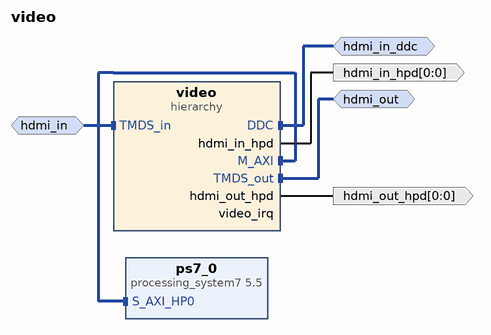
[diagram p0: block diagram of the top level]
# Vivado block design video, xc7z020clg400-1, Vivado 2018.2
create_bd_design video

create_bd_intf_port -mode Slave -vlnv digilentinc.com:interface:tmds_rtl:1.0 hdmi_in
create_bd_intf_port -mode Master -vlnv xilinx.com:interface:iic_rtl:1.0 hdmi_in_ddc
create_bd_intf_port -mode Master -vlnv digilentinc.com:interface:tmds_rtl:1.0 hdmi_out
create_bd_port -dir O -from 0 -to 0 hdmi_in_hpd
create_bd_port -dir O -from 0 -to 0 hdmi_out_hpd

create_bd_cell -type ip -vlnv xilinx.com:ip:processing_system7:5.5 ps7_0
set_property -dict [list \
  CONFIG.PCW_FCLK_CLK1_BUF TRUE \
  CONFIG.PCW_FCLK_CLK2_BUF TRUE \
  CONFIG.PCW_FCLK_CLK3_BUF TRUE \
  CONFIG.PCW_UIPARAM_DDR_FREQ_MHZ 525 \
  CONFIG.PCW_CRYSTAL_PERIPHERAL_FREQMHZ 50 \
  CONFIG.PCW_APU_PERIPHERAL_FREQMHZ 650 \
  CONFIG.PCW_SDIO_PERIPHERAL_FREQMHZ 50 \
  CONFIG.PCW_UART_PERIPHERAL_FREQMHZ 100 \
  CONFIG.PCW_I2C_PERIPHERAL_FREQMHZ 108.333336 \
  CONFIG.PCW_FPGA0_PERIPHERAL_FREQMHZ 100 \
  CONFIG.PCW_FPGA1_PERIPHERAL_FREQMHZ 142 \
  CONFIG.PCW_FPGA2_PERIPHERAL_FREQMHZ 200 \
  CONFIG.PCW_FPGA3_PERIPHERAL_FREQMHZ 100 \
  CONFIG.PCW_USE_M_AXI_GP1 1 \
  CONFIG.PCW_USE_S_AXI_GP0 1 \
  CONFIG.PCW_USE_S_AXI_HP0 1 \
  CONFIG.PCW_USE_S_AXI_HP2 1 \
  CONFIG.PCW_USE_FABRIC_INTERRUPT 1 \
  CONFIG.PCW_GPIO_EMIO_GPIO_WIDTH 10 \
  CONFIG.PCW_EN_CLK1_PORT 1 \
  CONFIG.PCW_EN_CLK2_PORT 1 \
  CONFIG.PCW_EN_CLK3_PORT 1 \
  CONFIG.PCW_IRQ_F2P_INTR 1 \
  CONFIG.PCW_PERIPHERAL_BOARD_PRESET None \
  CONFIG.PCW_PRESET_BANK1_VOLTAGE {LVCMOS 1.8V} \
  CONFIG.PCW_UIPARAM_DDR_BUS_WIDTH {16 Bit} \
  CONFIG.PCW_UIPARAM_DDR_PARTNO Custom \
  CONFIG.PCW_QSPI_PERIPHERAL_ENABLE 1 \
  CONFIG.PCW_QSPI_QSPI_IO {MIO 1 .. 6} \
  CONFIG.PCW_QSPI_GRP_SINGLE_SS_ENABLE 1 \
  CONFIG.PCW_QSPI_GRP_SINGLE_SS_IO {MIO 1 .. 6} \
  CONFIG.PCW_SINGLE_QSPI_DATA_MODE x4 \
  CONFIG.PCW_QSPI_GRP_FBCLK_ENABLE 1 \
  CONFIG.PCW_QSPI_GRP_FBCLK_IO {MIO 8} \
  CONFIG.PCW_ENET0_PERIPHERAL_ENABLE 1 \
  CONFIG.PCW_ENET0_ENET0_IO {MIO 16 .. 27} \
  CONFIG.PCW_ENET0_GRP_MDIO_ENABLE 1 \
  CONFIG.PCW_ENET0_GRP_MDIO_IO {MIO 52 .. 53} \
  CONFIG.PCW_SD0_PERIPHERAL_ENABLE 1 \
  CONFIG.PCW_SD0_SD0_IO {MIO 40 .. 45} \
  CONFIG.PCW_SD0_GRP_CD_ENABLE 1 \
  CONFIG.PCW_SD0_GRP_CD_IO {MIO 47} \
  CONFIG.PCW_SD0_GRP_WP_ENABLE 0 \
  CONFIG.PCW_UART0_PERIPHERAL_ENABLE 1 \
  CONFIG.PCW_UART0_UART0_IO {MIO 14 .. 15} \
  CONFIG.PCW_UART1_PERIPHERAL_ENABLE 0 \
  CONFIG.PCW_USB0_PERIPHERAL_ENABLE 1 \
  CONFIG.PCW_USB0_USB0_IO {MIO 28 .. 39} \
  CONFIG.PCW_I2C0_PERIPHERAL_ENABLE 1 \
  CONFIG.PCW_I2C0_I2C0_IO {MIO 50 .. 51} \
  CONFIG.PCW_I2C0_GRP_INT_ENABLE 1 \
  CONFIG.PCW_I2C0_GRP_INT_IO EMIO \
  CONFIG.PCW_I2C1_PERIPHERAL_ENABLE 1 \
  CONFIG.PCW_I2C1_I2C1_IO EMIO \
  CONFIG.PCW_GPIO_MIO_GPIO_ENABLE 0 \
  CONFIG.PCW_GPIO_EMIO_GPIO_ENABLE 1 \
  CONFIG.PCW_GPIO_EMIO_GPIO_IO 10 \
  CONFIG.PCW_FPGA_FCLK1_ENABLE 1 \
  CONFIG.PCW_FPGA_FCLK2_ENABLE 1 \
  CONFIG.PCW_FPGA_FCLK3_ENABLE 1 \
] [get_bd_cells ps7_0]
# 491 more settings of ps7_0 are not shown: defaults, MIO pin electricals, DDR timing, and values the tool derives
create_bd_cell -type hier video

# ---- hierarchy /video ----
current_bd_instance /video
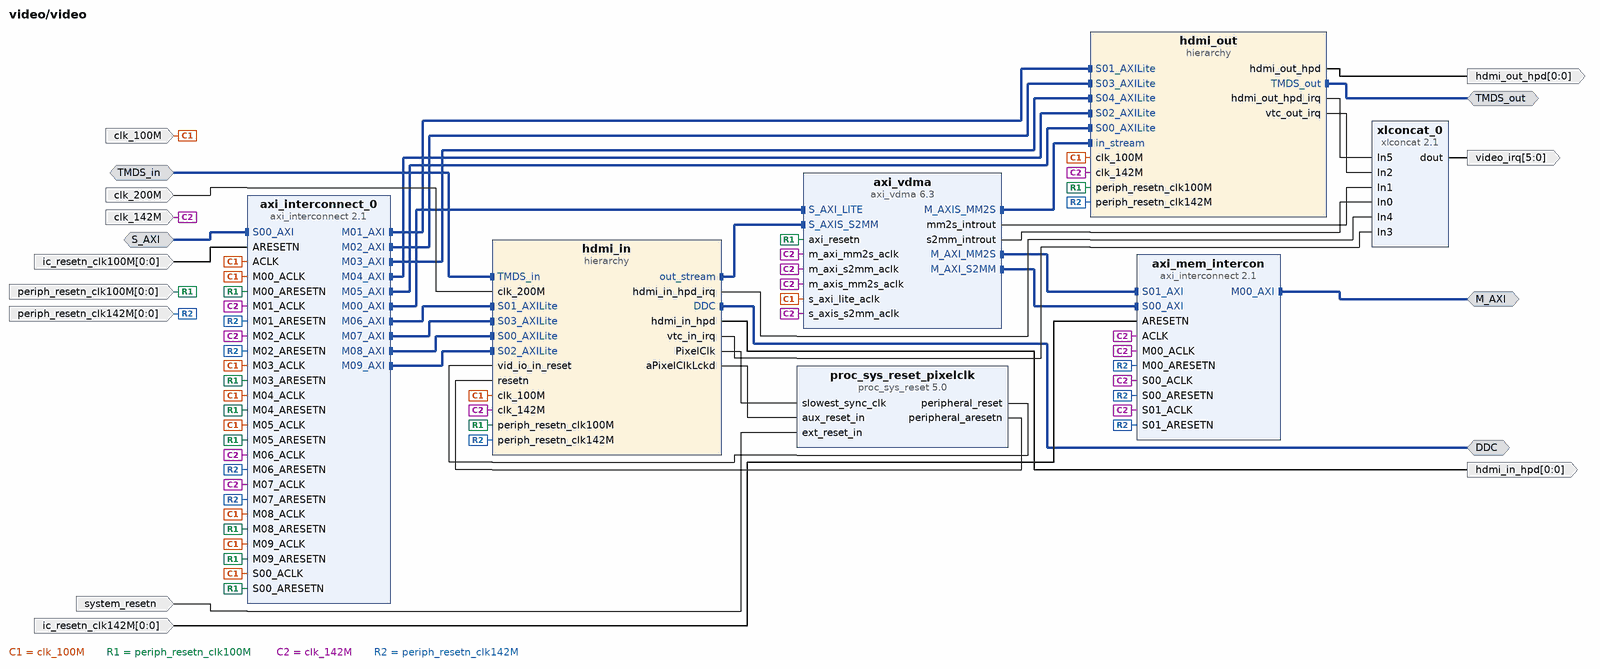
[diagram p1: block diagram inside /video]
create_bd_intf_pin -mode Master -vlnv xilinx.com:interface:iic_rtl:1.0 DDC
create_bd_intf_pin -mode Master -vlnv xilinx.com:interface:aximm_rtl:1.0 M_AXI
create_bd_intf_pin -mode Slave -vlnv xilinx.com:interface:aximm_rtl:1.0 S_AXI
create_bd_intf_pin -mode Slave -vlnv digilentinc.com:interface:tmds_rtl:1.0 TMDS_in
create_bd_intf_pin -mode Master -vlnv digilentinc.com:interface:tmds_rtl:1.0 TMDS_out
create_bd_pin -dir I -type clk clk_100M
create_bd_pin -dir I clk_142M
create_bd_pin -dir I -type clk clk_200M
create_bd_pin -dir O -from 0 -to 0 hdmi_in_hpd
create_bd_pin -dir O -from 0 -to 0 hdmi_out_hpd
create_bd_pin -dir I -from 0 -to 0 -type rst ic_resetn_clk100M
create_bd_pin -dir I -from 0 -to 0 -type rst ic_resetn_clk142M
create_bd_pin -dir I -from 0 -to 0 -type rst periph_resetn_clk100M
create_bd_pin -dir I -from 0 -to 0 -type rst periph_resetn_clk142M
create_bd_pin -dir I -type rst system_resetn
create_bd_pin -dir O -from 5 -to 0 video_irq

create_bd_cell -type ip -vlnv xilinx.com:ip:axi_interconnect:2.1 axi_interconnect_0
set_property -dict [list \
  CONFIG.NUM_MI 10 \
  CONFIG.M00_HAS_REGSLICE 1 \
  CONFIG.M01_HAS_REGSLICE 1 \
  CONFIG.M02_HAS_REGSLICE 1 \
  CONFIG.M03_HAS_REGSLICE 1 \
  CONFIG.M04_HAS_REGSLICE 1 \
  CONFIG.M05_HAS_REGSLICE 1 \
  CONFIG.M06_HAS_REGSLICE 1 \
  CONFIG.M07_HAS_REGSLICE 1 \
  CONFIG.M08_HAS_REGSLICE 1 \
  CONFIG.M09_HAS_REGSLICE 1 \
  CONFIG.S00_HAS_REGSLICE 1 \
] [get_bd_cells axi_interconnect_0]
create_bd_cell -type ip -vlnv xilinx.com:ip:axi_interconnect:2.1 axi_mem_intercon
set_property -dict {CONFIG.NUM_SI 2 CONFIG.NUM_MI 1} [get_bd_cells axi_mem_intercon]
create_bd_cell -type ip -vlnv xilinx.com:ip:axi_vdma:6.3 axi_vdma
set_property -dict [list \
  CONFIG.c_m_axi_mm2s_data_width 32 \
  CONFIG.c_m_axis_mm2s_tdata_width 32 \
  CONFIG.c_num_fstores 4 \
  CONFIG.c_mm2s_genlock_mode 1 \
  CONFIG.c_s2mm_genlock_mode 0 \
  CONFIG.c_mm2s_linebuffer_depth 512 \
  CONFIG.c_s2mm_linebuffer_depth 4096 \
  CONFIG.c_mm2s_max_burst_length 32 \
  CONFIG.c_s2mm_max_burst_length 32 \
] [get_bd_cells axi_vdma]
create_bd_cell -type hier hdmi_in
create_bd_cell -type hier hdmi_out
create_bd_cell -type ip -vlnv xilinx.com:ip:proc_sys_reset:5.0 proc_sys_reset_pixelclk
create_bd_cell -type ip -vlnv xilinx.com:ip:xlconcat:2.1 xlconcat_0
set_property -dict {CONFIG.NUM_PORTS 6} [get_bd_cells xlconcat_0]

# ---- hierarchy /video/hdmi_in ----
current_bd_instance /video/hdmi_in
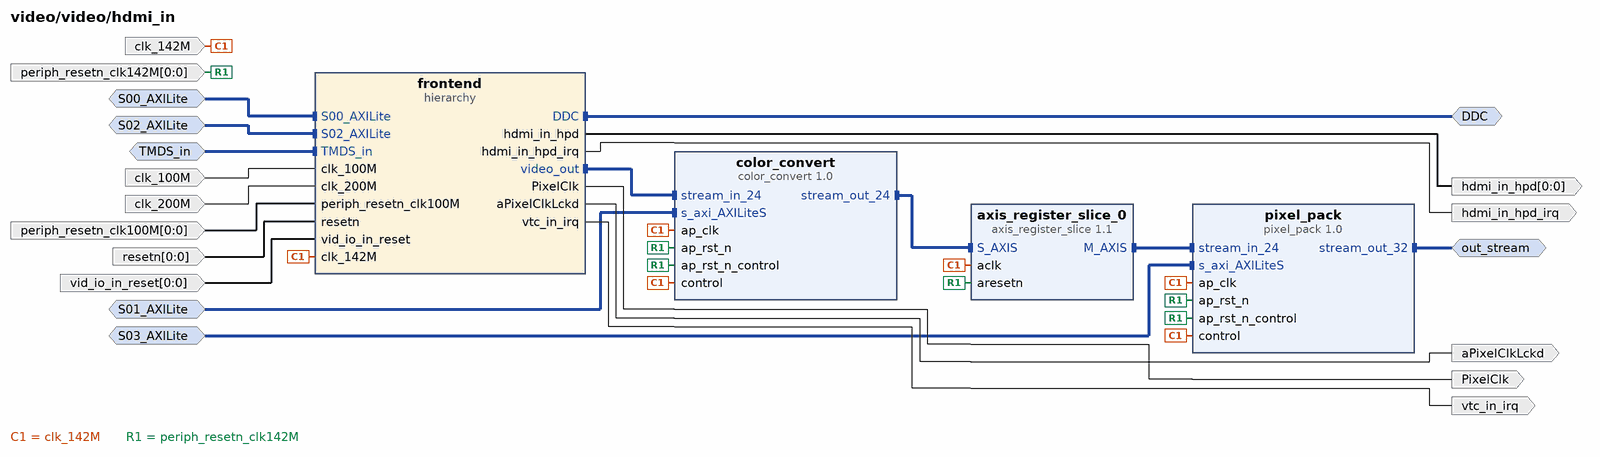
[diagram p2: block diagram inside /video/hdmi_in]
create_bd_intf_pin -mode Master -vlnv xilinx.com:interface:iic_rtl:1.0 DDC
create_bd_intf_pin -mode Slave -vlnv xilinx.com:interface:aximm_rtl:1.0 S00_AXILite
create_bd_intf_pin -mode Slave -vlnv xilinx.com:interface:aximm_rtl:1.0 S01_AXILite
create_bd_intf_pin -mode Slave -vlnv xilinx.com:interface:aximm_rtl:1.0 S02_AXILite
create_bd_intf_pin -mode Slave -vlnv xilinx.com:interface:aximm_rtl:1.0 S03_AXILite
create_bd_intf_pin -mode Slave -vlnv digilentinc.com:interface:tmds_rtl:1.0 TMDS_in
create_bd_intf_pin -mode Master -vlnv xilinx.com:interface:axis_rtl:1.0 out_stream
create_bd_pin -dir O -type clk PixelClk
create_bd_pin -dir O aPixelClkLckd
create_bd_pin -dir I -type clk clk_100M
create_bd_pin -dir I -type clk clk_142M
create_bd_pin -dir I -type clk clk_200M
create_bd_pin -dir O -from 0 -to 0 hdmi_in_hpd
create_bd_pin -dir O -type intr hdmi_in_hpd_irq
create_bd_pin -dir I -from 0 -to 0 -type rst periph_resetn_clk100M
create_bd_pin -dir I -from 0 -to 0 -type rst periph_resetn_clk142M
create_bd_pin -dir I -from 0 -to 0 -type rst resetn
create_bd_pin -dir I -from 0 -to 0 -type rst vid_io_in_reset
create_bd_pin -dir O -type intr vtc_in_irq

create_bd_cell -type ip -vlnv xilinx.com:ip:axis_register_slice:1.1 axis_register_slice_0
create_bd_cell -type ip -vlnv xilinx.com:hls:color_convert:1.0 color_convert
create_bd_cell -type hier frontend
create_bd_cell -type ip -vlnv xilinx.com:hls:pixel_pack:1.0 pixel_pack

# ---- hierarchy /video/hdmi_in/frontend ----
current_bd_instance /video/hdmi_in/frontend
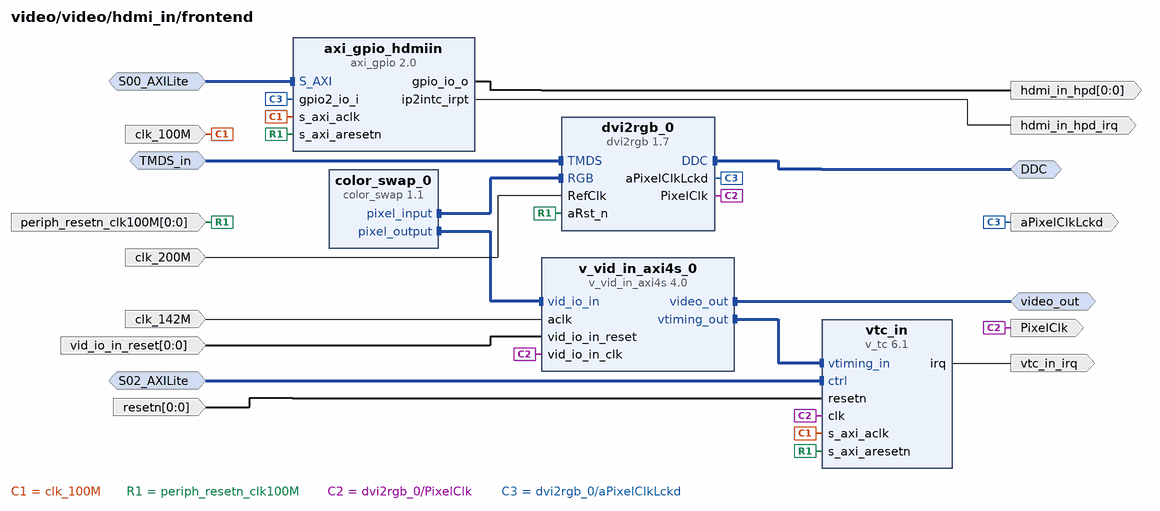
[diagram p3: block diagram inside /video/hdmi_in/frontend]
create_bd_intf_pin -mode Master -vlnv xilinx.com:interface:iic_rtl:1.0 DDC
create_bd_intf_pin -mode Slave -vlnv xilinx.com:interface:aximm_rtl:1.0 S00_AXILite
create_bd_intf_pin -mode Slave -vlnv xilinx.com:interface:aximm_rtl:1.0 S02_AXILite
create_bd_intf_pin -mode Slave -vlnv digilentinc.com:interface:tmds_rtl:1.0 TMDS_in
create_bd_intf_pin -mode Master -vlnv xilinx.com:interface:axis_rtl:1.0 video_out
create_bd_pin -dir O -type clk PixelClk
create_bd_pin -dir O aPixelClkLckd
create_bd_pin -dir I -type clk clk_100M
create_bd_pin -dir I -type clk clk_142M
create_bd_pin -dir I -type clk clk_200M
create_bd_pin -dir O -from 0 -to 0 hdmi_in_hpd
create_bd_pin -dir O -type intr hdmi_in_hpd_irq
create_bd_pin -dir I -from 0 -to 0 -type rst periph_resetn_clk100M
create_bd_pin -dir I -from 0 -to 0 -type rst resetn
create_bd_pin -dir I -from 0 -to 0 -type rst vid_io_in_reset
create_bd_pin -dir O -type intr vtc_in_irq

create_bd_cell -type ip -vlnv xilinx.com:ip:axi_gpio:2.0 axi_gpio_hdmiin
set_property -dict [list \
  CONFIG.C_GPIO_WIDTH 1 \
  CONFIG.C_GPIO2_WIDTH 1 \
  CONFIG.C_IS_DUAL 1 \
  CONFIG.C_ALL_INPUTS_2 1 \
  CONFIG.C_INTERRUPT_PRESENT 1 \
  CONFIG.C_ALL_OUTPUTS 1 \
] [get_bd_cells axi_gpio_hdmiin]
create_bd_cell -type ip -vlnv xilinx.com:user:color_swap:1.1 color_swap_0
set_property -dict {CONFIG.input_format rbg CONFIG.output_format rgb} [get_bd_cells color_swap_0]
create_bd_cell -type ip -vlnv digilentinc.com:ip:dvi2rgb:1.7 dvi2rgb_0
set_property -dict [list \
  CONFIG.kRstActiveHigh false \
  CONFIG.kClkRange 1 \
  CONFIG.kAddBUFG false \
  CONFIG.kEdidFileName 720p_edid.data \
] [get_bd_cells dvi2rgb_0]
create_bd_cell -type ip -vlnv xilinx.com:ip:v_vid_in_axi4s:4.0 v_vid_in_axi4s_0
set_property -dict {CONFIG.C_HAS_ASYNC_CLK 1 CONFIG.C_ADDR_WIDTH 12} [get_bd_cells v_vid_in_axi4s_0]
create_bd_cell -type ip -vlnv xilinx.com:ip:v_tc:6.1 vtc_in
set_property -dict [list \
  CONFIG.HAS_INTC_IF true \
  CONFIG.max_lines_per_frame 2048 \
  CONFIG.horizontal_blank_detection false \
  CONFIG.enable_generation false \
  CONFIG.vertical_blank_detection false \
] [get_bd_cells vtc_in]

# ---- hierarchy /video/hdmi_out ----
current_bd_instance /video/hdmi_out
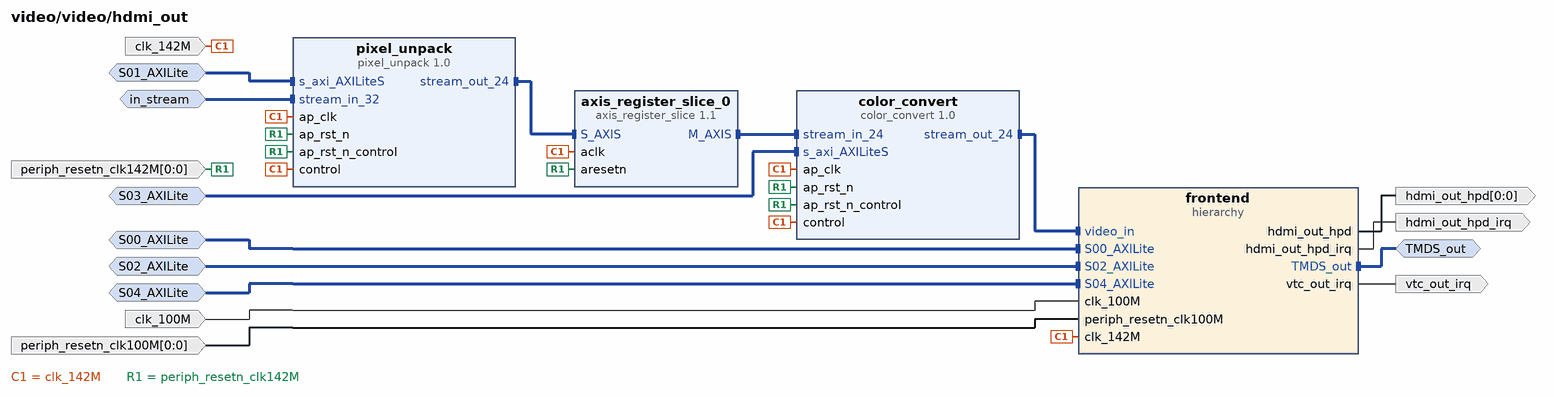
[diagram p4: block diagram inside /video/hdmi_out]
create_bd_intf_pin -mode Slave -vlnv xilinx.com:interface:aximm_rtl:1.0 S00_AXILite
create_bd_intf_pin -mode Slave -vlnv xilinx.com:interface:aximm_rtl:1.0 S01_AXILite
create_bd_intf_pin -mode Slave -vlnv xilinx.com:interface:aximm_rtl:1.0 S02_AXILite
create_bd_intf_pin -mode Slave -vlnv xilinx.com:interface:aximm_rtl:1.0 S03_AXILite
create_bd_intf_pin -mode Slave -vlnv xilinx.com:interface:aximm_rtl:1.0 S04_AXILite
create_bd_intf_pin -mode Master -vlnv digilentinc.com:interface:tmds_rtl:1.0 TMDS_out
create_bd_intf_pin -mode Slave -vlnv xilinx.com:interface:axis_rtl:1.0 in_stream
create_bd_pin -dir I -type clk clk_100M
create_bd_pin -dir I -type clk clk_142M
create_bd_pin -dir O -from 0 -to 0 hdmi_out_hpd
create_bd_pin -dir O -type intr hdmi_out_hpd_irq
create_bd_pin -dir I -from 0 -to 0 -type rst periph_resetn_clk100M
create_bd_pin -dir I -from 0 -to 0 -type rst periph_resetn_clk142M
create_bd_pin -dir O -type intr vtc_out_irq

create_bd_cell -type ip -vlnv xilinx.com:ip:axis_register_slice:1.1 axis_register_slice_0
create_bd_cell -type ip -vlnv xilinx.com:hls:color_convert:1.0 color_convert
create_bd_cell -type hier frontend
create_bd_cell -type ip -vlnv xilinx.com:hls:pixel_unpack:1.0 pixel_unpack

# ---- hierarchy /video/hdmi_out/frontend ----
current_bd_instance /video/hdmi_out/frontend
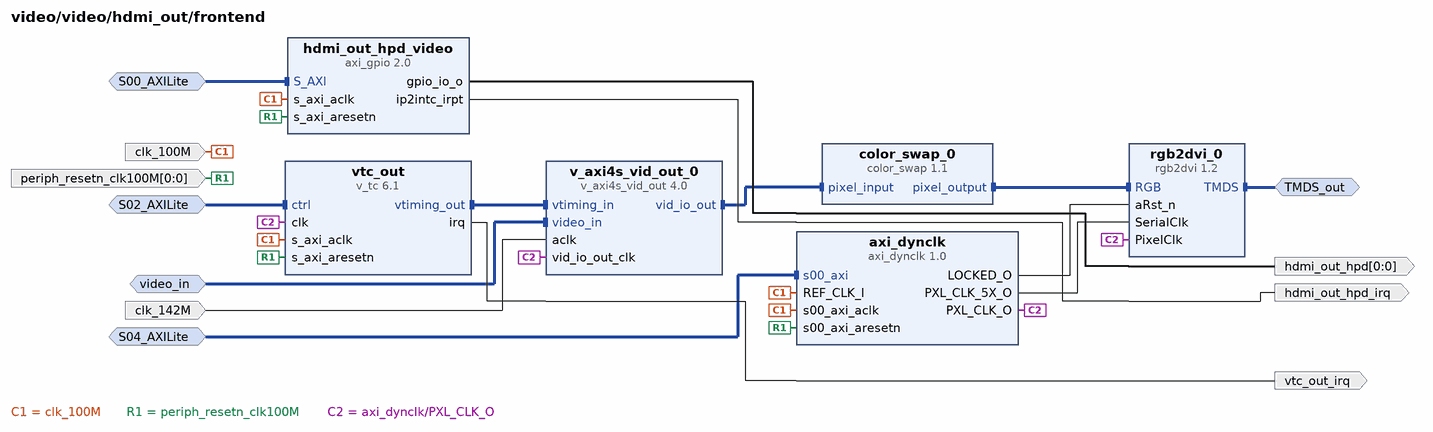
[diagram p5: block diagram inside /video/hdmi_out/frontend]
create_bd_intf_pin -mode Slave -vlnv xilinx.com:interface:aximm_rtl:1.0 S00_AXILite
create_bd_intf_pin -mode Slave -vlnv xilinx.com:interface:aximm_rtl:1.0 S02_AXILite
create_bd_intf_pin -mode Slave -vlnv xilinx.com:interface:aximm_rtl:1.0 S04_AXILite
create_bd_intf_pin -mode Master -vlnv digilentinc.com:interface:tmds_rtl:1.0 TMDS_out
create_bd_intf_pin -mode Slave -vlnv xilinx.com:interface:axis_rtl:1.0 video_in
create_bd_pin -dir I -type clk clk_100M
create_bd_pin -dir I -type clk clk_142M
create_bd_pin -dir O -from 0 -to 0 hdmi_out_hpd
create_bd_pin -dir O -type intr hdmi_out_hpd_irq
create_bd_pin -dir I -from 0 -to 0 -type rst periph_resetn_clk100M
create_bd_pin -dir O -type intr vtc_out_irq

create_bd_cell -type ip -vlnv digilentinc.com:ip:axi_dynclk:1.0 axi_dynclk
create_bd_cell -type ip -vlnv xilinx.com:user:color_swap:1.1 color_swap_0
create_bd_cell -type ip -vlnv xilinx.com:ip:axi_gpio:2.0 hdmi_out_hpd_video
set_property -dict {CONFIG.C_GPIO_WIDTH 1 CONFIG.C_INTERRUPT_PRESENT 1 CONFIG.C_ALL_OUTPUTS 1} [get_bd_cells hdmi_out_hpd_video]
create_bd_cell -type ip -vlnv digilentinc.com:ip:rgb2dvi:1.2 rgb2dvi_0
set_property -dict {CONFIG.kRstActiveHigh false CONFIG.kGenerateSerialClk false CONFIG.kClkRange 2} [get_bd_cells rgb2dvi_0]
create_bd_cell -type ip -vlnv xilinx.com:ip:v_axi4s_vid_out:4.0 v_axi4s_vid_out_0
set_property -dict [list \
  CONFIG.C_HAS_ASYNC_CLK 1 \
  CONFIG.C_ADDR_WIDTH 11 \
  CONFIG.C_HYSTERESIS_LEVEL 1024 \
  CONFIG.C_VTG_MASTER_SLAVE 1 \
] [get_bd_cells v_axi4s_vid_out_0]
create_bd_cell -type ip -vlnv xilinx.com:ip:v_tc:6.1 vtc_out
set_property -dict {CONFIG.enable_detection false} [get_bd_cells vtc_out]

# ---- connections ----

current_bd_instance /video
connect_bd_intf_net [get_bd_intf_pins axi_interconnect_0/M00_AXI] [get_bd_intf_pins axi_vdma/S_AXI_LITE]
connect_bd_intf_net [get_bd_intf_pins axi_interconnect_0/M01_AXI] [get_bd_intf_pins hdmi_out/S01_AXILite]
connect_bd_intf_net [get_bd_intf_pins axi_interconnect_0/M02_AXI] [get_bd_intf_pins hdmi_out/S03_AXILite]
connect_bd_intf_net [get_bd_intf_pins axi_interconnect_0/M03_AXI] [get_bd_intf_pins hdmi_out/S04_AXILite]
connect_bd_intf_net [get_bd_intf_pins axi_interconnect_0/M04_AXI] [get_bd_intf_pins hdmi_out/S02_AXILite]
connect_bd_intf_net [get_bd_intf_pins axi_interconnect_0/M05_AXI] [get_bd_intf_pins hdmi_out/S00_AXILite]
connect_bd_intf_net [get_bd_intf_pins axi_interconnect_0/M06_AXI] [get_bd_intf_pins hdmi_in/S01_AXILite]
connect_bd_intf_net [get_bd_intf_pins axi_interconnect_0/M07_AXI] [get_bd_intf_pins hdmi_in/S03_AXILite]
connect_bd_intf_net [get_bd_intf_pins axi_interconnect_0/M08_AXI] [get_bd_intf_pins hdmi_in/S00_AXILite]
connect_bd_intf_net [get_bd_intf_pins axi_interconnect_0/M09_AXI] [get_bd_intf_pins hdmi_in/S02_AXILite]
connect_bd_intf_net -intf_net axi_vdma_0_M_AXIS_MM2S [get_bd_intf_pins axi_vdma/M_AXIS_MM2S] [get_bd_intf_pins hdmi_out/in_stream]
connect_bd_intf_net -intf_net axi_vdma_0_M_AXI_MM2S [get_bd_intf_pins axi_mem_intercon/S01_AXI] [get_bd_intf_pins axi_vdma/M_AXI_MM2S]
connect_bd_intf_net -intf_net axi_vdma_0_M_AXI_S2MM [get_bd_intf_pins axi_mem_intercon/S00_AXI] [get_bd_intf_pins axi_vdma/M_AXI_S2MM]
connect_bd_intf_net -intf_net in_pixelformat_M00_AXIS [get_bd_intf_pins axi_vdma/S_AXIS_S2MM] [get_bd_intf_pins hdmi_in/out_stream]
connect_bd_intf_net -intf_net frontend_DDC [get_bd_intf_pins DDC] [get_bd_intf_pins hdmi_in/DDC]
connect_bd_intf_net [get_bd_intf_pins M_AXI] [get_bd_intf_pins axi_mem_intercon/M00_AXI]
connect_bd_intf_net [get_bd_intf_pins S_AXI] [get_bd_intf_pins axi_interconnect_0/S00_AXI]
connect_bd_intf_net -intf_net TMDS_1 [get_bd_intf_pins TMDS_in] [get_bd_intf_pins hdmi_in/TMDS_in]
connect_bd_intf_net [get_bd_intf_pins TMDS_out] [get_bd_intf_pins hdmi_out/TMDS_out]
connect_bd_net -net ARESETN_1 [get_bd_pins ic_resetn_clk100M] [get_bd_pins axi_interconnect_0/ARESETN]
connect_bd_net [get_bd_pins clk_100M] \
  [get_bd_pins axi_vdma/s_axi_lite_aclk] [get_bd_pins axi_interconnect_0/ACLK] [get_bd_pins axi_interconnect_0/M00_ACLK] \
  [get_bd_pins axi_interconnect_0/M03_ACLK] [get_bd_pins axi_interconnect_0/M04_ACLK] \
  [get_bd_pins axi_interconnect_0/M05_ACLK] [get_bd_pins axi_interconnect_0/M08_ACLK] \
  [get_bd_pins axi_interconnect_0/M09_ACLK] [get_bd_pins axi_interconnect_0/S00_ACLK] [get_bd_pins hdmi_in/clk_100M] \
  [get_bd_pins hdmi_out/clk_100M]
connect_bd_net [get_bd_pins periph_resetn_clk100M] \
  [get_bd_pins axi_vdma/axi_resetn] [get_bd_pins axi_interconnect_0/M00_ARESETN] [get_bd_pins axi_interconnect_0/M03_ARESETN] \
  [get_bd_pins axi_interconnect_0/M04_ARESETN] [get_bd_pins axi_interconnect_0/M05_ARESETN] \
  [get_bd_pins axi_interconnect_0/M08_ARESETN] [get_bd_pins axi_interconnect_0/M09_ARESETN] \
  [get_bd_pins axi_interconnect_0/S00_ARESETN] [get_bd_pins hdmi_in/periph_resetn_clk100M] \
  [get_bd_pins hdmi_out/periph_resetn_clk100M]
connect_bd_net -net RefClk_1 [get_bd_pins clk_200M] [get_bd_pins hdmi_in/clk_200M]
connect_bd_net -net aclk_1 [get_bd_pins clk_142M] \
  [get_bd_pins axi_vdma/m_axi_mm2s_aclk] [get_bd_pins axi_vdma/m_axi_s2mm_aclk] [get_bd_pins axi_vdma/m_axis_mm2s_aclk] \
  [get_bd_pins axi_vdma/s_axis_s2mm_aclk] [get_bd_pins axi_interconnect_0/M01_ACLK] [get_bd_pins axi_interconnect_0/M02_ACLK] \
  [get_bd_pins axi_interconnect_0/M06_ACLK] [get_bd_pins axi_interconnect_0/M07_ACLK] [get_bd_pins axi_mem_intercon/ACLK] \
  [get_bd_pins axi_mem_intercon/M00_ACLK] [get_bd_pins axi_mem_intercon/S00_ACLK] [get_bd_pins axi_mem_intercon/S01_ACLK] \
  [get_bd_pins hdmi_in/clk_142M] [get_bd_pins hdmi_out/clk_142M]
connect_bd_net -net axi_gpio_video_gpio_io_o [get_bd_pins hdmi_in/hdmi_in_hpd] [get_bd_pins hdmi_in_hpd]
connect_bd_net -net axi_gpio_video_ip2intc_irpt [get_bd_pins hdmi_in/hdmi_in_hpd_irq] [get_bd_pins xlconcat_0/In4]
connect_bd_net -net axi_vdma_0_mm2s_introut [get_bd_pins axi_vdma/mm2s_introut] [get_bd_pins xlconcat_0/In1]
connect_bd_net -net axi_vdma_0_s2mm_introut [get_bd_pins axi_vdma/s2mm_introut] [get_bd_pins xlconcat_0/In0]
connect_bd_net -net ext_reset_in_1 [get_bd_pins system_resetn] [get_bd_pins proc_sys_reset_pixelclk/ext_reset_in]
connect_bd_net [get_bd_pins hdmi_in/PixelClk] [get_bd_pins proc_sys_reset_pixelclk/slowest_sync_clk]
connect_bd_net [get_bd_pins hdmi_in/aPixelClkLckd] [get_bd_pins proc_sys_reset_pixelclk/aux_reset_in]
connect_bd_net -net hdmi_out_hpd_video_gpio_io_o [get_bd_pins hdmi_out/hdmi_out_hpd] [get_bd_pins hdmi_out_hpd]
connect_bd_net -net hdmi_out_hpd_video_ip2intc_irpt [get_bd_pins hdmi_out/hdmi_out_hpd_irq] [get_bd_pins xlconcat_0/In5]
connect_bd_net -net rst_ps7_0_100M_interconnect_aresetn [get_bd_pins ic_resetn_clk142M] [get_bd_pins axi_mem_intercon/ARESETN]
connect_bd_net -net rst_ps7_0_100M_peripheral_aresetn [get_bd_pins periph_resetn_clk142M] \
  [get_bd_pins axi_interconnect_0/M01_ARESETN] [get_bd_pins axi_interconnect_0/M02_ARESETN] \
  [get_bd_pins axi_interconnect_0/M06_ARESETN] [get_bd_pins axi_interconnect_0/M07_ARESETN] \
  [get_bd_pins axi_mem_intercon/M00_ARESETN] [get_bd_pins axi_mem_intercon/S00_ARESETN] \
  [get_bd_pins axi_mem_intercon/S01_ARESETN] [get_bd_pins hdmi_in/periph_resetn_clk142M] \
  [get_bd_pins hdmi_out/periph_resetn_clk142M]
connect_bd_net -net v_tc_0_irq [get_bd_pins hdmi_out/vtc_out_irq] [get_bd_pins xlconcat_0/In2]
connect_bd_net -net v_tc_1_irq [get_bd_pins hdmi_in/vtc_in_irq] [get_bd_pins xlconcat_0/In3]
connect_bd_net -net vid_io_in_reset_1 [get_bd_pins proc_sys_reset_pixelclk/peripheral_reset] [get_bd_pins hdmi_in/vid_io_in_reset]
connect_bd_net -net vtc_in_resetn_1 [get_bd_pins proc_sys_reset_pixelclk/peripheral_aresetn] [get_bd_pins hdmi_in/resetn]
connect_bd_net [get_bd_pins xlconcat_0/dout] [get_bd_pins video_irq]

current_bd_instance /video/hdmi_in
connect_bd_intf_net [get_bd_intf_pins axis_register_slice_0/M_AXIS] [get_bd_intf_pins pixel_pack/stream_in_24]
connect_bd_intf_net [get_bd_intf_pins axis_register_slice_0/S_AXIS] [get_bd_intf_pins color_convert/stream_out_24]
connect_bd_intf_net [get_bd_intf_pins color_convert/stream_in_24] [get_bd_intf_pins frontend/video_out]
connect_bd_intf_net [get_bd_intf_pins DDC] [get_bd_intf_pins frontend/DDC]
connect_bd_intf_net [get_bd_intf_pins S00_AXILite] [get_bd_intf_pins frontend/S00_AXILite]
connect_bd_intf_net [get_bd_intf_pins S01_AXILite] [get_bd_intf_pins color_convert/s_axi_AXILiteS]
connect_bd_intf_net [get_bd_intf_pins S02_AXILite] [get_bd_intf_pins frontend/S02_AXILite]
connect_bd_intf_net [get_bd_intf_pins S03_AXILite] [get_bd_intf_pins pixel_pack/s_axi_AXILiteS]
connect_bd_intf_net -intf_net TMDS_1 [get_bd_intf_pins TMDS_in] [get_bd_intf_pins frontend/TMDS_in]
connect_bd_intf_net [get_bd_intf_pins out_stream] [get_bd_intf_pins pixel_pack/stream_out_32]
connect_bd_net [get_bd_pins clk_100M] [get_bd_pins frontend/clk_100M]
connect_bd_net -net RefClk_1 [get_bd_pins clk_200M] [get_bd_pins frontend/clk_200M]
connect_bd_net -net aclk_1 [get_bd_pins clk_142M] \
  [get_bd_pins axis_register_slice_0/aclk] [get_bd_pins color_convert/ap_clk] [get_bd_pins color_convert/control] \
  [get_bd_pins pixel_pack/ap_clk] [get_bd_pins pixel_pack/control] [get_bd_pins frontend/clk_142M]
connect_bd_net -net axi_gpio_video_gpio_io_o [get_bd_pins frontend/hdmi_in_hpd] [get_bd_pins hdmi_in_hpd]
connect_bd_net -net axi_gpio_video_ip2intc_irpt [get_bd_pins frontend/hdmi_in_hpd_irq] [get_bd_pins hdmi_in_hpd_irq]
connect_bd_net -net dvi2rgb_0_PixelClk [get_bd_pins frontend/PixelClk] [get_bd_pins PixelClk]
connect_bd_net -net dvi2rgb_0_aPixelClkLckd [get_bd_pins frontend/aPixelClkLckd] [get_bd_pins aPixelClkLckd]
connect_bd_net [get_bd_pins periph_resetn_clk100M] [get_bd_pins frontend/periph_resetn_clk100M]
connect_bd_net [get_bd_pins resetn] [get_bd_pins frontend/resetn]
connect_bd_net -net rst_ps7_0_100M_peripheral_aresetn [get_bd_pins periph_resetn_clk142M] \
  [get_bd_pins axis_register_slice_0/aresetn] [get_bd_pins color_convert/ap_rst_n] \
  [get_bd_pins color_convert/ap_rst_n_control] [get_bd_pins pixel_pack/ap_rst_n] [get_bd_pins pixel_pack/ap_rst_n_control]
connect_bd_net -net v_tc_1_irq [get_bd_pins frontend/vtc_in_irq] [get_bd_pins vtc_in_irq]
connect_bd_net [get_bd_pins vid_io_in_reset] [get_bd_pins frontend/vid_io_in_reset]

current_bd_instance /video/hdmi_in/frontend
connect_bd_intf_net [get_bd_intf_pins color_swap_0/pixel_output] [get_bd_intf_pins v_vid_in_axi4s_0/vid_io_in]
connect_bd_intf_net [get_bd_intf_pins color_swap_0/pixel_input] [get_bd_intf_pins dvi2rgb_0/RGB]
connect_bd_intf_net [get_bd_intf_pins v_vid_in_axi4s_0/vtiming_out] [get_bd_intf_pins vtc_in/vtiming_in]
connect_bd_intf_net [get_bd_intf_pins DDC] [get_bd_intf_pins dvi2rgb_0/DDC]
connect_bd_intf_net [get_bd_intf_pins S00_AXILite] [get_bd_intf_pins axi_gpio_hdmiin/S_AXI]
connect_bd_intf_net [get_bd_intf_pins S02_AXILite] [get_bd_intf_pins vtc_in/ctrl]
connect_bd_intf_net [get_bd_intf_pins TMDS_in] [get_bd_intf_pins dvi2rgb_0/TMDS]
connect_bd_intf_net -intf_net hdmi_in_video_out [get_bd_intf_pins video_out] [get_bd_intf_pins v_vid_in_axi4s_0/video_out]
connect_bd_net [get_bd_pins clk_100M] [get_bd_pins axi_gpio_hdmiin/s_axi_aclk] [get_bd_pins vtc_in/s_axi_aclk]
connect_bd_net [get_bd_pins periph_resetn_clk100M] \
  [get_bd_pins axi_gpio_hdmiin/s_axi_aresetn] [get_bd_pins dvi2rgb_0/aRst_n] [get_bd_pins vtc_in/s_axi_aresetn]
connect_bd_net -net RefClk_1 [get_bd_pins clk_200M] [get_bd_pins dvi2rgb_0/RefClk]
connect_bd_net -net aclk_1 [get_bd_pins clk_142M] [get_bd_pins v_vid_in_axi4s_0/aclk]
connect_bd_net -net axi_gpio_video_gpio_io_o [get_bd_pins axi_gpio_hdmiin/gpio_io_o] [get_bd_pins hdmi_in_hpd]
connect_bd_net -net axi_gpio_video_ip2intc_irpt [get_bd_pins axi_gpio_hdmiin/ip2intc_irpt] [get_bd_pins hdmi_in_hpd_irq]
connect_bd_net [get_bd_pins dvi2rgb_0/PixelClk] [get_bd_pins PixelClk] [get_bd_pins v_vid_in_axi4s_0/vid_io_in_clk] [get_bd_pins vtc_in/clk]
connect_bd_net [get_bd_pins dvi2rgb_0/aPixelClkLckd] [get_bd_pins aPixelClkLckd] [get_bd_pins axi_gpio_hdmiin/gpio2_io_i]
connect_bd_net [get_bd_pins resetn] [get_bd_pins vtc_in/resetn]
connect_bd_net -net v_tc_1_irq [get_bd_pins vtc_in/irq] [get_bd_pins vtc_in_irq]
connect_bd_net [get_bd_pins vid_io_in_reset] [get_bd_pins v_vid_in_axi4s_0/vid_io_in_reset]

current_bd_instance /video/hdmi_out
connect_bd_intf_net [get_bd_intf_pins axis_register_slice_0/M_AXIS] [get_bd_intf_pins color_convert/stream_in_24]
connect_bd_intf_net [get_bd_intf_pins color_convert/stream_out_24] [get_bd_intf_pins frontend/video_in]
connect_bd_intf_net [get_bd_intf_pins axis_register_slice_0/S_AXIS] [get_bd_intf_pins pixel_unpack/stream_out_24]
connect_bd_intf_net [get_bd_intf_pins S00_AXILite] [get_bd_intf_pins frontend/S00_AXILite]
connect_bd_intf_net [get_bd_intf_pins S01_AXILite] [get_bd_intf_pins pixel_unpack/s_axi_AXILiteS]
connect_bd_intf_net [get_bd_intf_pins S02_AXILite] [get_bd_intf_pins frontend/S02_AXILite]
connect_bd_intf_net [get_bd_intf_pins S03_AXILite] [get_bd_intf_pins color_convert/s_axi_AXILiteS]
connect_bd_intf_net [get_bd_intf_pins S04_AXILite] [get_bd_intf_pins frontend/S04_AXILite]
connect_bd_intf_net [get_bd_intf_pins TMDS_out] [get_bd_intf_pins frontend/TMDS_out]
connect_bd_intf_net [get_bd_intf_pins in_stream] [get_bd_intf_pins pixel_unpack/stream_in_32]
connect_bd_net [get_bd_pins clk_100M] [get_bd_pins frontend/clk_100M]
connect_bd_net [get_bd_pins periph_resetn_clk100M] [get_bd_pins frontend/periph_resetn_clk100M]
connect_bd_net -net aclk_1 [get_bd_pins clk_142M] \
  [get_bd_pins axis_register_slice_0/aclk] [get_bd_pins color_convert/ap_clk] [get_bd_pins color_convert/control] \
  [get_bd_pins pixel_unpack/ap_clk] [get_bd_pins pixel_unpack/control] [get_bd_pins frontend/clk_142M]
connect_bd_net -net hdmi_out_hpd_video_gpio_io_o [get_bd_pins frontend/hdmi_out_hpd] [get_bd_pins hdmi_out_hpd]
connect_bd_net -net hdmi_out_hpd_video_ip2intc_irpt [get_bd_pins frontend/hdmi_out_hpd_irq] [get_bd_pins hdmi_out_hpd_irq]
connect_bd_net -net rst_ps7_0_100M_peripheral_aresetn [get_bd_pins periph_resetn_clk142M] \
  [get_bd_pins axis_register_slice_0/aresetn] [get_bd_pins color_convert/ap_rst_n] \
  [get_bd_pins color_convert/ap_rst_n_control] [get_bd_pins pixel_unpack/ap_rst_n] \
  [get_bd_pins pixel_unpack/ap_rst_n_control]
connect_bd_net -net v_tc_0_irq [get_bd_pins frontend/vtc_out_irq] [get_bd_pins vtc_out_irq]

current_bd_instance /video/hdmi_out/frontend
connect_bd_intf_net [get_bd_intf_pins color_swap_0/pixel_output] [get_bd_intf_pins rgb2dvi_0/RGB]
connect_bd_intf_net [get_bd_intf_pins color_swap_0/pixel_input] [get_bd_intf_pins v_axi4s_vid_out_0/vid_io_out]
connect_bd_intf_net -intf_net v_tc_0_vtiming_out [get_bd_intf_pins v_axi4s_vid_out_0/vtiming_in] [get_bd_intf_pins vtc_out/vtiming_out]
connect_bd_intf_net [get_bd_intf_pins S00_AXILite] [get_bd_intf_pins hdmi_out_hpd_video/S_AXI]
connect_bd_intf_net [get_bd_intf_pins S02_AXILite] [get_bd_intf_pins vtc_out/ctrl]
connect_bd_intf_net [get_bd_intf_pins S04_AXILite] [get_bd_intf_pins axi_dynclk/s00_axi]
connect_bd_intf_net [get_bd_intf_pins TMDS_out] [get_bd_intf_pins rgb2dvi_0/TMDS]
connect_bd_intf_net [get_bd_intf_pins video_in] [get_bd_intf_pins v_axi4s_vid_out_0/video_in]
connect_bd_net [get_bd_pins clk_100M] \
  [get_bd_pins axi_dynclk/REF_CLK_I] [get_bd_pins axi_dynclk/s00_axi_aclk] [get_bd_pins hdmi_out_hpd_video/s_axi_aclk] \
  [get_bd_pins vtc_out/s_axi_aclk]
connect_bd_net [get_bd_pins periph_resetn_clk100M] \
  [get_bd_pins axi_dynclk/s00_axi_aresetn] [get_bd_pins hdmi_out_hpd_video/s_axi_aresetn] [get_bd_pins vtc_out/s_axi_aresetn]
connect_bd_net -net aclk_1 [get_bd_pins clk_142M] [get_bd_pins v_axi4s_vid_out_0/aclk]
connect_bd_net -net axi_dynclk_0_LOCKED_O [get_bd_pins axi_dynclk/LOCKED_O] [get_bd_pins rgb2dvi_0/aRst_n]
connect_bd_net -net axi_dynclk_0_PXL_CLK_5X_O [get_bd_pins axi_dynclk/PXL_CLK_5X_O] [get_bd_pins rgb2dvi_0/SerialClk]
connect_bd_net -net axi_dynclk_0_PXL_CLK_O [get_bd_pins axi_dynclk/PXL_CLK_O] \
  [get_bd_pins rgb2dvi_0/PixelClk] [get_bd_pins v_axi4s_vid_out_0/vid_io_out_clk] [get_bd_pins vtc_out/clk]
connect_bd_net [get_bd_pins hdmi_out_hpd_video/gpio_io_o] [get_bd_pins hdmi_out_hpd]
connect_bd_net [get_bd_pins hdmi_out_hpd_video/ip2intc_irpt] [get_bd_pins hdmi_out_hpd_irq]
connect_bd_net -net v_tc_0_irq [get_bd_pins vtc_out/irq] [get_bd_pins vtc_out_irq]

current_bd_instance /
connect_bd_intf_net -intf_net axi_mem_intercon_M00_AXI [get_bd_intf_pins ps7_0/S_AXI_HP0] [get_bd_intf_pins video/M_AXI]
connect_bd_intf_net [get_bd_intf_ports hdmi_in] [get_bd_intf_pins video/TMDS_in]
connect_bd_intf_net -intf_net dvi2rgb_0_DDC [get_bd_intf_ports hdmi_in_ddc] [get_bd_intf_pins video/DDC]
connect_bd_intf_net -intf_net video_TMDS1 [get_bd_intf_ports hdmi_out] [get_bd_intf_pins video/TMDS_out]
connect_bd_net -net axi_gpio_video_gpio_io_o [get_bd_pins video/hdmi_in_hpd] [get_bd_ports hdmi_in_hpd]
connect_bd_net -net hdmi_out_hpd_video_gpio_io_o [get_bd_pins video/hdmi_out_hpd] [get_bd_ports hdmi_out_hpd]
# net video_dout has one end: video/video_irq

# ---- address map ----
assign_bd_address -offset 0x41220000 -range 64K -target_address_space [get_bd_addr_spaces ps7_0/Data] [get_bd_addr_segs video/hdmi_in/frontend/axi_gpio_hdmiin/S_AXI/Reg]
assign_bd_address -offset 0x41230000 -range 64K -target_address_space [get_bd_addr_spaces ps7_0/Data] [get_bd_addr_segs video/hdmi_out/frontend/hdmi_out_hpd_video/S_AXI/Reg]
assign_bd_address -offset 0x43000000 -range 64K -target_address_space [get_bd_addr_spaces ps7_0/Data] [get_bd_addr_segs video/axi_vdma/S_AXI_LITE/Reg]
assign_bd_address -offset 0x43C10000 -range 64K -target_address_space [get_bd_addr_spaces ps7_0/Data] [get_bd_addr_segs video/hdmi_out/frontend/axi_dynclk/s00_axi/reg0]
assign_bd_address -offset 0x43C20000 -range 64K -target_address_space [get_bd_addr_spaces ps7_0/Data] [get_bd_addr_segs video/hdmi_out/frontend/vtc_out/ctrl/Reg]
assign_bd_address -offset 0x43C30000 -range 64K -target_address_space [get_bd_addr_spaces ps7_0/Data] [get_bd_addr_segs video/hdmi_in/frontend/vtc_in/ctrl/Reg]
assign_bd_address -offset 0x43C40000 -range 64K -target_address_space [get_bd_addr_spaces ps7_0/Data] [get_bd_addr_segs video/hdmi_in/pixel_pack/s_axi_AXILiteS/Reg]
assign_bd_address -offset 0x43C50000 -range 64K -target_address_space [get_bd_addr_spaces ps7_0/Data] [get_bd_addr_segs video/hdmi_in/color_convert/s_axi_AXILiteS/Reg]
assign_bd_address -offset 0x43C60000 -range 64K -target_address_space [get_bd_addr_spaces ps7_0/Data] [get_bd_addr_segs video/hdmi_out/color_convert/s_axi_AXILiteS/Reg]
assign_bd_address -offset 0x43C70000 -range 64K -target_address_space [get_bd_addr_spaces ps7_0/Data] [get_bd_addr_segs video/hdmi_out/pixel_unpack/s_axi_AXILiteS/Reg]
assign_bd_address -offset 0x00000000 -range 512M -target_address_space [get_bd_addr_spaces video/axi_vdma/Data_MM2S] [get_bd_addr_segs ps7_0/S_AXI_HP2/HP2_DDR_LOWOCM]
assign_bd_address -offset 0x00000000 -range 512M -target_address_space [get_bd_addr_spaces video/axi_vdma/Data_S2MM] [get_bd_addr_segs ps7_0/S_AXI_HP2/HP2_DDR_LOWOCM]

validate_bd_design
save_bd_design
